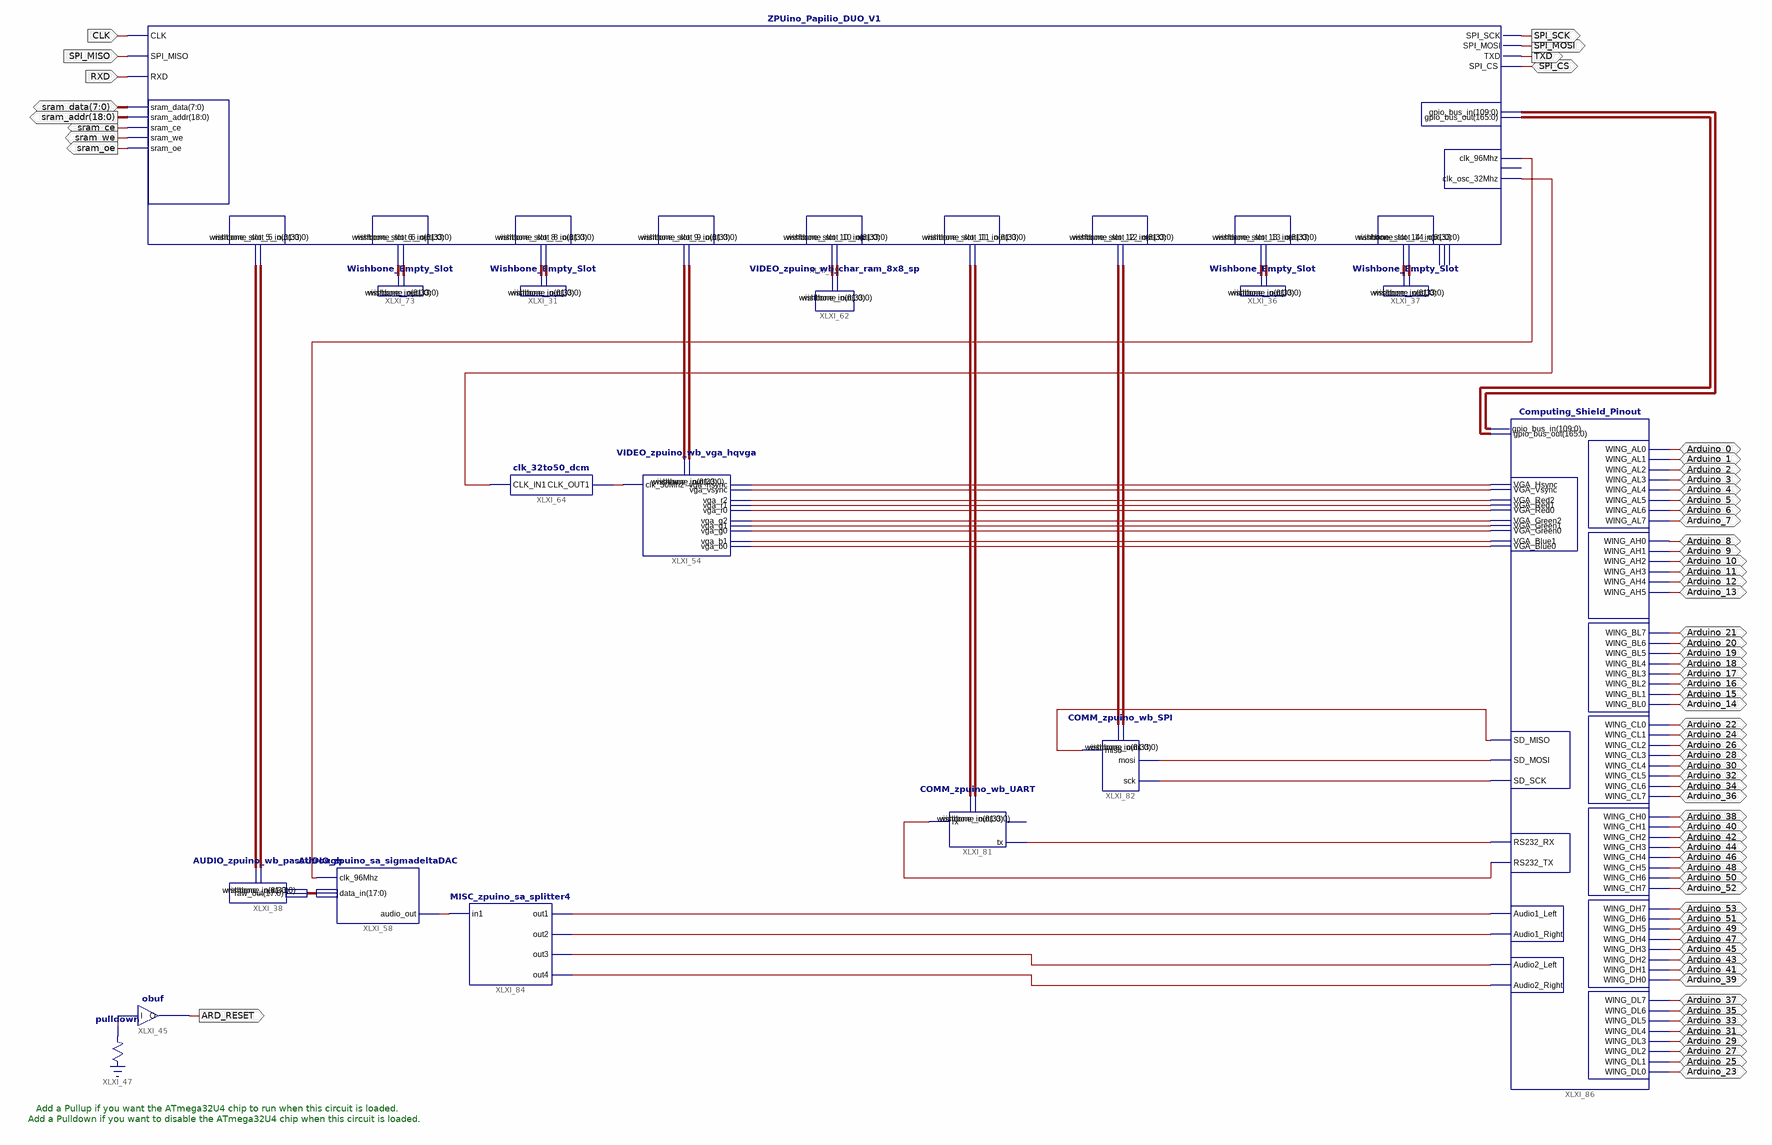
[diagram p0: schematic sheet 1]
// Xilinx ISE schematic Papilio_DUO_LX9.sch (spartan6) as structural Verilog: 16 symbols, 67 ports
module Papilio_DUO_LX9 (
  input  RXD,
  input  SPI_MISO,
  input  CLK,
  inout  Arduino_0,
  inout  Arduino_1,
  inout  Arduino_2,
  inout  Arduino_3,
  inout  Arduino_4,
  inout  Arduino_5,
  inout  Arduino_6,
  inout  Arduino_7,
  inout  Arduino_8,
  inout  Arduino_9,
  inout  Arduino_10,
  inout  Arduino_11,
  inout  Arduino_12,
  inout  Arduino_13,
  inout  Arduino_21,
  inout  Arduino_20,
  inout  Arduino_19,
  inout  Arduino_18,
  inout  Arduino_17,
  inout  Arduino_16,
  inout  Arduino_15,
  inout  Arduino_14,
  inout  SPI_CS,
  inout  [7:0] sram_data,
  inout  Arduino_22,
  inout  Arduino_24,
  inout  Arduino_26,
  inout  Arduino_28,
  inout  Arduino_30,
  inout  Arduino_32,
  inout  Arduino_34,
  inout  Arduino_36,
  inout  Arduino_38,
  inout  Arduino_40,
  inout  Arduino_42,
  inout  Arduino_44,
  inout  Arduino_46,
  inout  Arduino_48,
  inout  Arduino_50,
  inout  Arduino_52,
  inout  Arduino_39,
  inout  Arduino_41,
  inout  Arduino_43,
  inout  Arduino_45,
  inout  Arduino_47,
  inout  Arduino_49,
  inout  Arduino_51,
  inout  Arduino_53,
  inout  Arduino_37,
  inout  Arduino_35,
  inout  Arduino_33,
  inout  Arduino_31,
  inout  Arduino_29,
  inout  Arduino_27,
  inout  Arduino_25,
  inout  Arduino_23,
  output TXD,
  output SPI_MOSI,
  output SPI_SCK,
  output sram_ce,
  output sram_we,
  output sram_oe,
  output [18:0] sram_addr,
  output ARD_RESET
);

  wire XLXN_452, XLXN_456, XLXN_549, XLXN_584, XLXN_585, XLXN_586, XLXN_587, XLXN_588, XLXN_589, XLXN_590,
       XLXN_591, XLXN_592, XLXN_593, XLXN_596, XLXN_626, XLXN_629, XLXN_630, XLXN_633, XLXN_634, XLXN_635,
       XLXN_639, XLXN_640, XLXN_641, XLXN_642;
  wire [17:0] XLXN_450;
  wire [33:0] XLXN_431, XLXN_433, XLXN_443, XLXN_449, XLXN_537, XLXN_568, XLXN_623, XLXN_628, XLXN_632;
  wire [61:0] XLXN_430, XLXN_432, XLXN_442, XLXN_448, XLXN_536, XLXN_567, XLXN_622, XLXN_627, XLXN_631;
  wire [109:0] XLXN_409;
  wire [165:0] XLXN_408;

  ZPUino_Papilio_DUO_V1 XLXI_39 (
    .gpio_bus_out(XLXN_408), .gpio_bus_in(XLXN_409), .SPI_CS(SPI_CS), .TXD(TXD), .SPI_MOSI(SPI_MOSI),
    .SPI_SCK(SPI_SCK), .clk_96Mhz(XLXN_452), .clk_osc_32Mhz(XLXN_549), .sram_data(sram_data),
    .sram_ce(sram_ce), .sram_we(sram_we), .sram_oe(sram_oe), .CLK(CLK), .SPI_MISO(SPI_MISO), .RXD(RXD),
    .wishbone_slot_5_out(XLXN_449), .wishbone_slot_5_in(XLXN_448), .wishbone_slot_6_in(XLXN_622),
    .wishbone_slot_6_out(XLXN_623), .wishbone_slot_8_in(XLXN_442), .wishbone_slot_8_out(XLXN_443),
    .wishbone_slot_9_in(XLXN_536), .wishbone_slot_9_out(XLXN_537), .wishbone_slot_10_in(XLXN_567),
    .wishbone_slot_10_out(XLXN_568), .wishbone_slot_11_in(XLXN_627), .wishbone_slot_11_out(XLXN_628),
    .wishbone_slot_12_in(XLXN_631), .wishbone_slot_12_out(XLXN_632), .wishbone_slot_13_in(XLXN_432),
    .wishbone_slot_13_out(XLXN_433), .wishbone_slot_14_in(XLXN_430), .wishbone_slot_14_out(XLXN_431),
    .sram_addr(sram_addr));  // open: clk_1Mhz, wishbone_slot_video_in, wishbone_slot_video_out, vgaclkout
  \pulldown  XLXI_47 (.O(XLXN_456));
  obuf XLXI_45 (.I(XLXN_456), .O(ARD_RESET));
  Wishbone_Empty_Slot XLXI_37 (.wishbone_in(XLXN_430), .wishbone_out(XLXN_431));
  Wishbone_Empty_Slot XLXI_36 (.wishbone_in(XLXN_432), .wishbone_out(XLXN_433));
  Wishbone_Empty_Slot XLXI_31 (.wishbone_in(XLXN_442), .wishbone_out(XLXN_443));
  VIDEO_zpuino_wb_char_ram_8x8_sp XLXI_62 (.wishbone_in(XLXN_567), .wishbone_out(XLXN_568));
  VIDEO_zpuino_wb_vga_hqvga XLXI_54 (
    .clk_50Mhz(XLXN_596), .vga_hsync(XLXN_584), .vga_vsync(XLXN_585), .vga_r2(XLXN_586), .vga_r1(XLXN_587),
    .vga_r0(XLXN_588), .vga_g2(XLXN_589), .vga_g1(XLXN_590), .vga_g0(XLXN_591), .vga_b1(XLXN_592),
    .vga_b0(XLXN_593), .wishbone_in(XLXN_536), .wishbone_out(XLXN_537));
  clk_32to50_dcm XLXI_64 (.CLK_IN1(XLXN_549), .CLK_OUT1(XLXN_596));
  AUDIO_zpuino_wb_passthrough XLXI_38 (.raw_out(XLXN_450), .wishbone_in(XLXN_448), .wishbone_out(XLXN_449));
  AUDIO_zpuino_sa_sigmadeltaDAC XLXI_58 (.data_in(XLXN_450), .audio_out(XLXN_626), .clk_96Mhz(XLXN_452));
  Wishbone_Empty_Slot XLXI_73 (.wishbone_in(XLXN_622), .wishbone_out(XLXN_623));
  COMM_zpuino_wb_UART XLXI_81 (
    .rx(XLXN_630), .wishbone_in(XLXN_627), .wishbone_out(XLXN_628), .tx(XLXN_629));  // open: enabled
  COMM_zpuino_wb_SPI XLXI_82 (
    .miso(XLXN_633), .sck(XLXN_635), .mosi(XLXN_634), .wishbone_in(XLXN_631), .wishbone_out(XLXN_632));
  MISC_zpuino_sa_splitter4 XLXI_84 (.in1(XLXN_626), .out1(XLXN_639), .out2(XLXN_640), .out3(XLXN_641), .out4(XLXN_642));
  Computing_Shield_Pinout XLXI_86 (
    .gpio_bus_out(XLXN_408), .gpio_bus_in(XLXN_409), .WING_AL0(Arduino_0), .WING_AL1(Arduino_1),
    .WING_AL2(Arduino_2), .WING_AL3(Arduino_3), .WING_AL4(Arduino_4), .WING_AL5(Arduino_5),
    .WING_AL6(Arduino_6), .WING_AL7(Arduino_7), .WING_AH0(Arduino_8), .WING_AH1(Arduino_9),
    .WING_AH2(Arduino_10), .WING_AH3(Arduino_11), .WING_AH4(Arduino_12), .WING_AH5(Arduino_13),
    .VGA_Red2(XLXN_586), .VGA_Red1(XLXN_587), .VGA_Red0(XLXN_588), .VGA_Green2(XLXN_589),
    .VGA_Green1(XLXN_590), .VGA_Green0(XLXN_591), .VGA_Blue1(XLXN_592), .VGA_Blue0(XLXN_593),
    .VGA_Hsync(XLXN_584), .VGA_Vsync(XLXN_585), .Audio1_Left(XLXN_639), .WING_CL0(Arduino_22),
    .WING_CL1(Arduino_24), .WING_CL2(Arduino_26), .WING_CL3(Arduino_28), .WING_CL4(Arduino_30),
    .WING_CL5(Arduino_32), .WING_CL6(Arduino_34), .WING_CL7(Arduino_36), .WING_CH0(Arduino_38),
    .WING_CH1(Arduino_40), .WING_CH2(Arduino_42), .WING_CH3(Arduino_44), .WING_CH4(Arduino_46),
    .WING_CH5(Arduino_48), .WING_CH6(Arduino_50), .WING_CH7(Arduino_52), .SD_MISO(XLXN_633),
    .SD_MOSI(XLXN_634), .RS232_RX(XLXN_629), .RS232_TX(XLXN_630), .SD_SCK(XLXN_635), .Audio1_Right(XLXN_640),
    .Audio2_Right(XLXN_642), .Audio2_Left(XLXN_641), .WING_BL7(Arduino_21), .WING_BL6(Arduino_20),
    .WING_BL5(Arduino_19), .WING_BL4(Arduino_18), .WING_BL3(Arduino_17), .WING_BL2(Arduino_16),
    .WING_BL1(Arduino_15), .WING_BL0(Arduino_14), .WING_DL7(Arduino_37), .WING_DL6(Arduino_35),
    .WING_DL5(Arduino_33), .WING_DL4(Arduino_31), .WING_DL3(Arduino_29), .WING_DL2(Arduino_27),
    .WING_DL1(Arduino_25), .WING_DL0(Arduino_23), .WING_DH7(Arduino_53), .WING_DH6(Arduino_51),
    .WING_DH5(Arduino_49), .WING_DH4(Arduino_47), .WING_DH3(Arduino_45), .WING_DH2(Arduino_43),
    .WING_DH1(Arduino_41), .WING_DH0(Arduino_39));

  // Notes on the sheet:
  //   Add a Pullup if you want the ATmega32U4 chip to run when this circuit is loaded.
  //   Add a Pulldown if you want to disable the ATmega32U4 chip when this circuit is loaded.
endmodule
